# EAGLE schematic headstage-64-coax-adapter (EAGLE 8.3.2)
DESIGNER: Jon Newman; DESIGN_NAME: Headstage-64 Coax Adapter (Regulated); LICENSE: CC BY-NC-SA 4.0; REVISION: 1.1
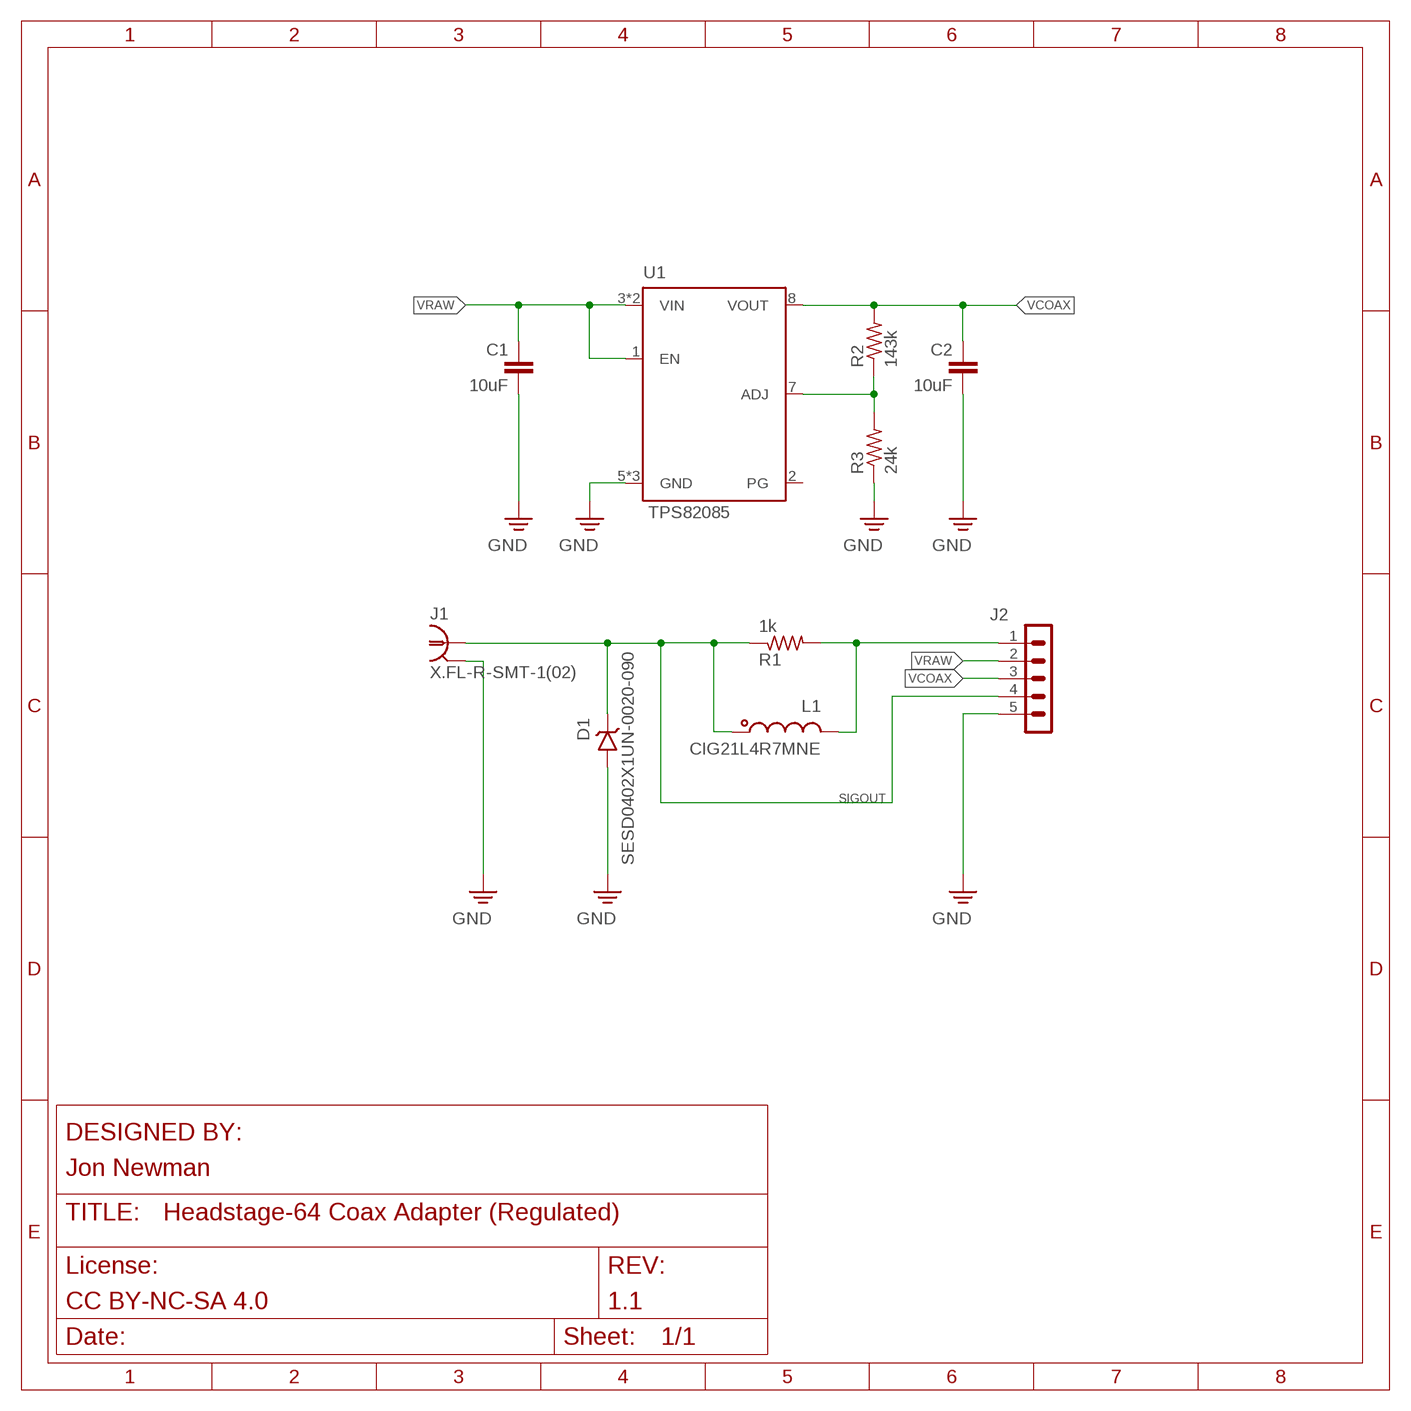
[diagram p0: schematic, sheet 1]

## Parts
C1  10uF  C_0402T  [0402T]
C2  10uF  C_0402T  [0402T]
D1  SESD0402X1UN-0020-090  Z-DIODE_0402T-DFN  [0402T-DFN]
J1  X.FL-R-SMT-1(02)  COAX_XFL  [X_FL_R_SMT_1(02)]
J2  PINHD-1X5_HEADSTAGE-64-REV1.4-DAUGHTER-CARD-CASTELLATED  [HEADSTAGE-64-REV1.4-DAUGHTER-CARD-CASTELLATED]
L1  CIG21L4R7MNE  L_0805T  [0805T]
R1  1k  R_0201T  [0201T]
R2  143k  R_0201T  [0201T]
R3  24k  R_0201T  [0201T]
U1  TPS82085  TPS8208X  [MICROSIP9-2.8X3]

## Nets
GND: C1.2 C2.2 D1.A J1.P$2 J1.P$3 J1.P$4 J2.5 R3.1 U1.5(GND) U1.6(GND) U1.PAD(GND)
N$2: R2.1 R3.2 U1.7(ADJ)
N$48: J2.1 L1.2 R1.2
SIGOUT: D1.C J1.P$1 J2.4 L1.1 R1.1
VCOAX: C2.1 J2.3 R2.2 U1.8(VOUT)
VRAW: C1.1 J2.2 U1.1(EN) U1.3(VIN) U1.4(VIN)
Unconnected: U1.2(PG)

## Library data of the parts
C1 C2 = jonnew:C: Capacitor; PARTNO: CL05A475MO5NUNC
D1 = jonnew:Z-DIODE: Zener Diode
J1 = jonnew:COAX: COAX CONNECTOR - Edge mount BNC - Vertical BNC - Vertical SMA - etc
J2 = jonnew:PINHD-1X5
L1 = jonnew:L: Inductor
R1-R3 = jonnew:R: Resistor
U1 = jonnew:TPS8208X